# EAGLE design e-Tapperhandpiece32 (EAGLE 8.5.1)
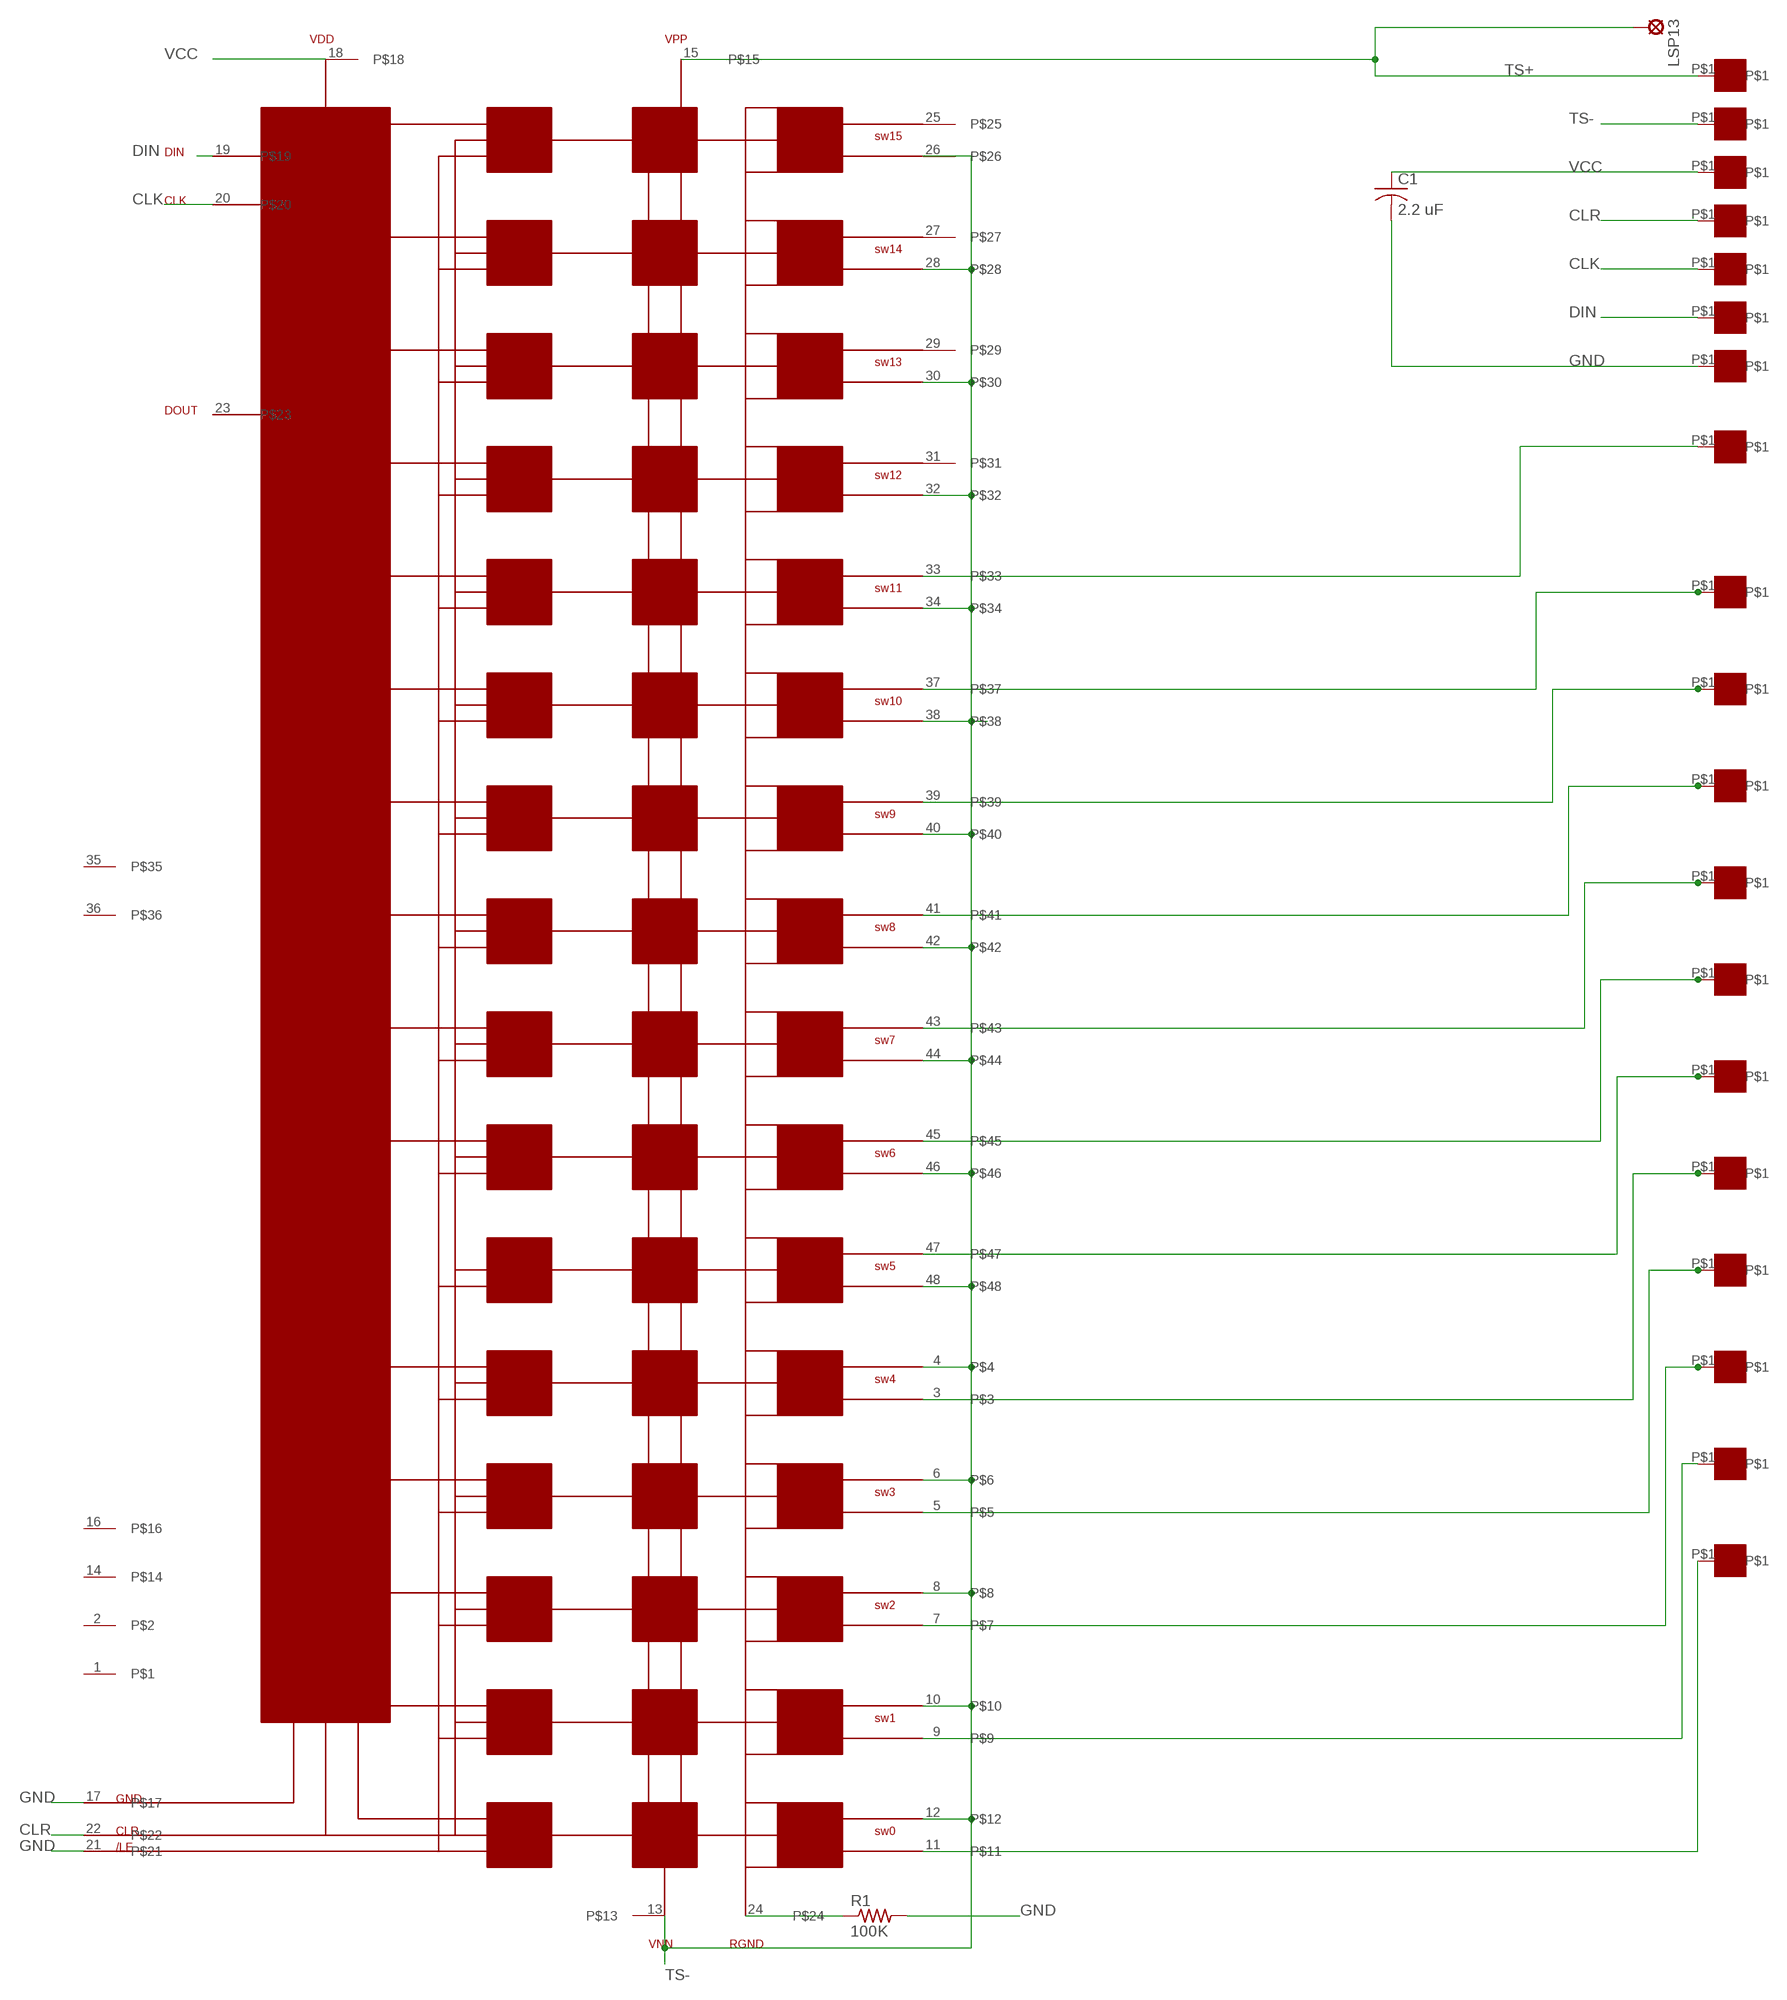
[diagram p0: schematic, sheet 1]

## Parts
C1  2.2 uF  C-USC0805  [C0805]
LSP13  SE11  [SE11]
R1  100K  R-US_R0603  [R0603]
TSP1  ET1  [ET1]
TSP2  ET1  [ET1]
TSP3  ET1  [ET1]
TSP4  ET1  [ET1]
TSP5  ET1  [ET1]
TSP6  ET1  [ET1]
TSP7  ET1  [ET1]
TSP8  ET1  [ET1]
TSP9  ET1  [ET1]
TSP10  ET1  [ET1]
TSP11  ET1  [ET1]
TSP12  ET1  [ET1]
TSP13  ET1  [ET1]
TSP14  ET1  [ET1]
TSP16  ET1  [ET1]
TSP17  ET1  [ET1]
TSP18  ET1  [ET1]
TSP19  ET1  [ET1]
U1  CPC7701  [LQFP48]
VCC  ET1  [ET1]

## Nets
CLK: TSP17.P$1 U1.20
CLR: TSP18.P$1 U1.22
DIN: TSP16.P$1 U1.19
GND: C1.2 R1.2 TSP19.P$1 U1.17 U1.21
N$1: R1.1 U1.24
N$4: TSP1.P$1 U1.33
N$6: TSP2.P$1 U1.37
N$10: TSP3.P$1 U1.39
N$11: TSP4.P$1 U1.41
N$12: TSP5.P$1 U1.43
N$13: TSP6.P$1 U1.45
N$14: TSP7.P$1 U1.47
N$15: TSP8.P$1 U1.3
N$16: TSP9.P$1 U1.5
N$17: TSP10.P$1 U1.7
N$21: TSP11.P$1 U1.9
N$26: TSP12.P$1 U1.11
TS+: LSP13.MP TSP13.P$1 U1.15
TS-: TSP14.P$1 U1.4 U1.6 U1.8 U1.10 U1.12 U1.13 U1.26 U1.28 U1.30 U1.32 U1.34 U1.38 U1.40 U1.42 U1.44 U1.46 U1.48
VCC: C1.1 U1.18 VCC.P$1
Unconnected: U1.1 U1.2 U1.14 U1.16 U1.23 U1.25 U1.27 U1.29 U1.31 U1.35 U1.36

## Library data of the parts
C1 = resistor:C-US: CAPACITOR, American symbol
LSP13 = solpad:SE11: SOLDER PAD RTM, drill 1,1mm, distributor Buerklin, 07F810
R1 = rcl:R-US_: RESISTOR, American symbol; SPICEPREFIX: R
TSP1-TSP14 TSP16-TSP19 VCC = ET1:ET1: Through Hold Pads 35 mil drill hole
U1 = CPC7701:CPC7701: High Voltage cmos 16 channel analog switch in 48 plcc package 3.3V logic level 200V switch

## Net classes
0 default: clearance 0.205 mm

## Board
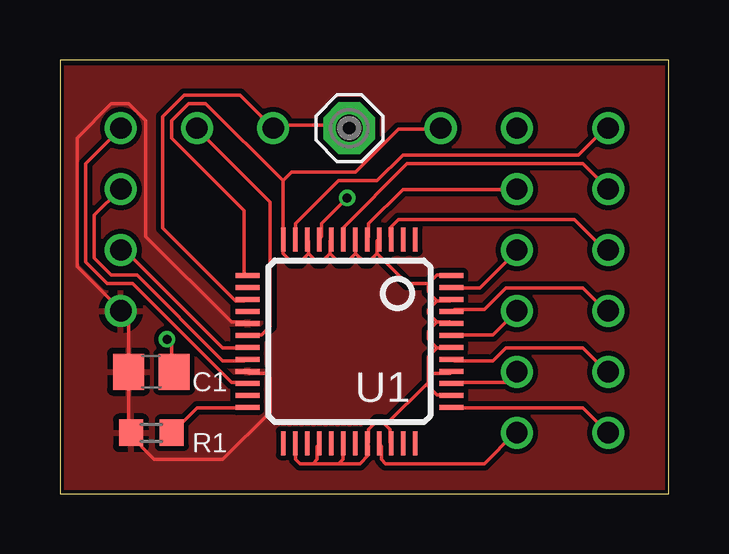
[diagram p1: board, top side]
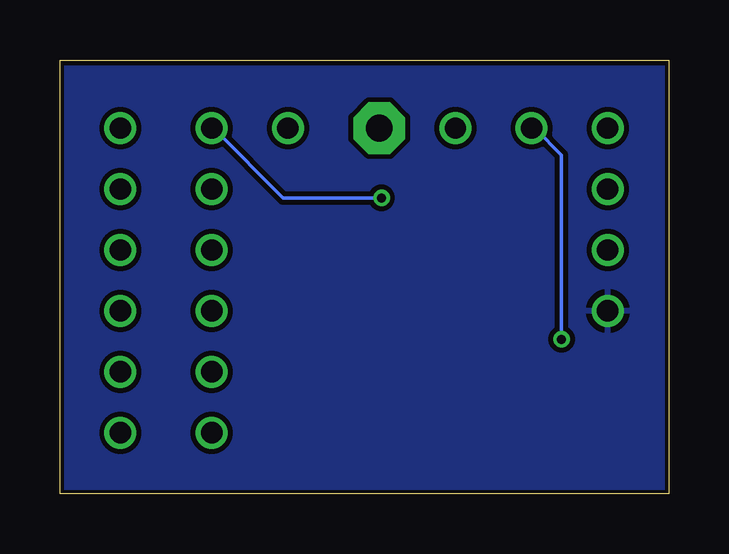
[diagram p2: board, bottom side, seen from below]

Size 25.38 x 18.09 mm. Coordinates in mm from the lower left corner, seen from the top.
Outline: 0,0 25.38,0 25.38,18.09 0,18.09 0,0
Copper layers (1*16): Top 0.035mm / dielectric 1.5mm / Bottom 0.035mm
Design rules "e-tapperhandpiece14 *": minimum track width 6mil, minimum drill 15mil, track to track 6mil, track to pad 6mil, pad to pad 6mil, via to via 6mil, smd to smd 6mil, copper to edge 6mil, drill to drill 6mil, minimum pad ring 6mil, minimum via ring 6mil, stop-mask expansion 4mil, vias tented up to drill 0mil, thermal gap 10mil

### Footprints (pad centres in the part's own frame; a part is rotated, then mirrored left to right if it is on the bottom)
C0805 = smd 1.3 x 1.5: 1 -0.95,0; 2 0.95,0
SE11 = drill 1.118 pad 2.159 octagon: MP 0,0
R0603 = smd 1 x 1.1: 1 -0.85,0; 2 0.85,0
ET1 = drill 0.889: P$1 0,0
LQFP48 = smd 0.2 x 1: 1 -2.75,-4.25; 2 -2.25,-4.25; 3 -1.75,-4.25; 4 -1.25,-4.25; 5 -0.75,-4.25; 6 -0.25,-4.25; 7 0.25,-4.25; 8 0.75,-4.25; 9 1.25,-4.25; 10 1.75,-4.25; 11 2.25,-4.25; 12 2.75,-4.25; 25 2.75,4.25; 26 2.25,4.25; 27 1.75,4.25; 28 1.25,4.25; 29 0.75,4.25; 30 0.25,4.25; 31 -0.25,4.25; 32 -0.75,4.25; 33 -1.25,4.25; 34 -1.75,4.25; 35 -2.25,4.25; 36 -2.75,4.25 | smd 1 x 0.2: 13 4.25,-2.75; 14 4.25,-2.25; 15 4.25,-1.75; 16 4.25,-1.25; 17 4.25,-0.75; 18 4.25,-0.25; 19 4.25,0.25; 20 4.25,0.75; 21 4.25,1.25; 22 4.25,1.75; 23 4.25,2.25; 24 4.25,2.75; 37 -4.25,2.75; 38 -4.25,2.25; 39 -4.25,1.75; 40 -4.25,1.25; 41 -4.25,0.75; 42 -4.25,0.25; 43 -4.25,-0.25; 44 -4.25,-0.75; 45 -4.25,-1.25; 46 -4.25,-1.75; 47 -4.25,-2.25; 48 -4.25,-2.75

### Placement (x,y rotation side)
C1  3.81,5.08 180 top
LSP13  12.06,15.24 0 top
R1  3.81,2.54 180 top
TSP1  19.05,2.54 0 top
TSP2  22.86,2.54 0 top
TSP3  19.05,5.08 0 top
TSP4  22.86,5.08 0 top
TSP5  19.05,7.62 0 top
TSP6  22.86,7.62 0 top
TSP7  19.05,10.16 0 top
TSP8  22.86,10.16 0 top
TSP9  19.05,12.7 0 top
TSP10  22.86,12.7 0 top
TSP11  19.05,15.24 0 top
TSP12  22.86,15.24 0 top
TSP13  8.89,15.24 0 top
TSP14  15.88,15.24 0 top
TSP16  2.54,10.16 180 top
TSP17  2.54,12.7 180 top
TSP18  2.54,15.24 270 top
TSP19  2.54,7.62 270 top
U1  12.06,6.35 180 top
VCC  5.71,15.24 180 top

### Tracks (layer width: path | path; a pad name or v marks a point on that pad's centre or on a via)
CLK
  Top 0.152: U1.20 7.68,5.54 6.79,5.54 3.22,9.11 2.14,9.11 1.43,9.83 1.43,11.62 2.5,12.69 TSP17.P$1
CLR
  Top 0.152: U1.22 7.68,4.65 7.15,4.65 3.04,8.76 1.97,8.76 1.07,9.65 1.07,13.76 2.5,15.19 TSP18.P$1
DIN
  Top 0.152: U1.19 7.68,6.08 6.79,6.08 2.68,10.19 TSP16.P$1
GND
  Top 0.152: U1.21 7.86,5 8.58,5 8.76,4.83 8.76,3.4 6.79,1.43 3.93,1.43 2.86,2.5 R1.2 2.86,2.68 2.86,5 C1.2 2.86,5.18 2.86,7.33 2.68,7.5 TSP19.P$1 2.5,7.68 0.71,9.47 0.71,14.83 2.14,16.26 2.86,16.26 3.57,15.55 3.57,10.72 7.15,7.15 7.68,7.15 U1.17
  pour Top: 0,17.78 25.4,17.78 25.4,0 0,0
  pour Bottom: 0,17.78 25.4,17.78 25.4,0 0,0
N$1
  Top 0.152: U1.24 7.68,3.57 5.72,3.57 4.83,2.68 R1.1
N$4
  Top 0.152: U1.33 13.4,1.97 13.4,1.43 13.58,1.25 17.69,1.25 18.94,2.5 TSP1.P$1
N$6
  Top 0.152: U1.37 16.44,3.57 21.8,3.57 22.7,2.68 TSP2.P$1
N$10
  Top 0.152: U1.39 16.44,4.65 18.59,4.65 18.94,5 TSP3.P$1
N$11
  Top 0.152: U1.41 16.44,5.54 18.05,5.54 18.59,6.08 21.8,6.08 22.7,5.18 TSP4.P$1
N$12
  Top 0.152: U1.43 16.44,6.61 18.05,6.61 18.94,7.5 TSP5.P$1
N$13
  Top 0.152: U1.45 16.44,7.68 17.69,7.68 18.59,8.58 21.8,8.58 22.7,7.68 TSP6.P$1
N$14
  Top 0.152: U1.47 16.44,8.58 17.51,8.58 18.94,10.01 TSP7.P$1
N$15
  Top 0.152: U1.3 13.76,10.72 13.76,11.08 14.12,11.44 21.44,11.44 22.7,10.19 TSP8.P$1
N$16
  Top 0.152: U1.5 12.87,10.72 12.87,11.26 14.3,12.69 18.94,12.69 TSP9.P$1
N$17
  Top 0.152: U1.7 11.79,10.72 11.79,11.08 14.47,13.76 21.8,13.76 22.7,12.87 TSP10.P$1
N$21  (via drill 0.38)
  Top 0.152: v11.97,12.33 10.9,11.26 10.9,10.72 U1.9
  Bottom 0.152: v11.97,12.33 16.08,12.33 18.94,15.19 TSP11.P$1
N$26
  Top 0.152: U1.11 9.83,10.72 9.83,11.26 11.62,13.04 13.22,13.04 14.3,14.12 21.62,14.12 22.7,15.19 TSP12.P$1
TS+
  Top 0.152: U1.15 7.68,8.04 7.33,8.04 4.29,11.08 4.29,15.73 5.18,16.62 7.5,16.62 8.76,15.37 TSP13.P$1 8.94,15.37 11.97,15.37 LSP13.MP
TS-
  Top 0.152: 10.54,1.25 10.01,1.25 9.83,1.43 9.83,1.97 U1.26 | 10.54,1.25 10.72,1.43 10.72,1.97 U1.28 | 11.62,1.25 11.79,1.43 11.79,1.97 U1.30 | 10.54,1.25 11.62,1.25 | 11.62,1.25 12.51,1.25 12.87,1.61 12.87,1.97 U1.32 12.87,2.14 12.87,2.68 13.22,3.04 13.4,3.04 13.58,2.86 | 13.58,2.86 13.76,2.68 13.76,2.14 U1.34 | 15.37,4.83 15.37,4.65 | 15.37,4.65 15.37,4.47 15.73,4.11 16.26,4.11 U1.38 | 15.37,4.83 15.55,5 16.26,5 U1.40 | 15.73,6.08 16.26,6.08 U1.42 | 15.73,6.08 15.37,5.72 15.37,4.83 | 15.73,7.15 16.26,7.15 U1.44 | 15.73,7.15 15.37,6.79 15.37,6.43 15.73,6.08 | 15.73,8.04 16.26,8.04 U1.46 | 15.73,8.04 15.37,7.68 15.37,7.5 15.73,7.15 | 15.37,8.76 15.73,9.11 16.26,9.11 U1.48 | 15.37,8.76 15.37,8.4 15.73,8.04 | 15.37,4.65 13.58,2.86 | 10.37,10.01 10.37,10.54 U1.10 | 10.37,10.01 10.72,9.65 10.9,9.65 11.26,10.01 | 11.26,10.01 11.26,10.54 U1.8 | 12.33,10.01 12.33,10.54 U1.6 | 12.33,10.01 11.97,9.65 11.62,9.65 11.26,10.01 | 13.22,10.01 13.22,10.54 U1.4 | 13.22,10.01 12.87,9.65 12.69,9.65 12.33,10.01 | 9.29,13.04 6.08,16.26 5.36,16.26 4.65,15.55 4.65,14.83 7.68,11.79 7.68,9.11 U1.13 | 9.29,13.04 9.29,10.72 U1.12 9.29,10.54 9.29,10.01 9.65,9.65 10.01,9.65 10.37,10.01 | 9.29,13.04 9.65,13.4 12.33,13.4 14.12,15.19 15.73,15.19 TSP14.P$1 | 15.37,8.76 14.47,8.76 13.22,10.01
VCC  (via drill 0.38)
  Top 0.152: U1.18 7.86,6.61 8.4,6.61 8.76,6.97 8.76,12.15 5.72,15.19 VCC.P$1 | v4.47,6.43 4.65,6.25 4.65,5.18 C1.1
  Bottom 0.152: v4.47,6.43 4.47,14.12 5.54,15.19 VCC.P$1

### Text on the board
tValues: VCC | TS+ | TS+ | TS- | CLR | TP2 | TP1 | CLK | TP4 | TP3 | DIN | TP6 | TP5 | GND | TP8 | TP7 | TP10 | TP9 | TP12 | TP11
tDocu: e-Tapper Handpiece R32 @All rights reserved